# EAGLE design labwiz-module_t420 (EAGLE 6.5.0)

## Sheet 1 of 2
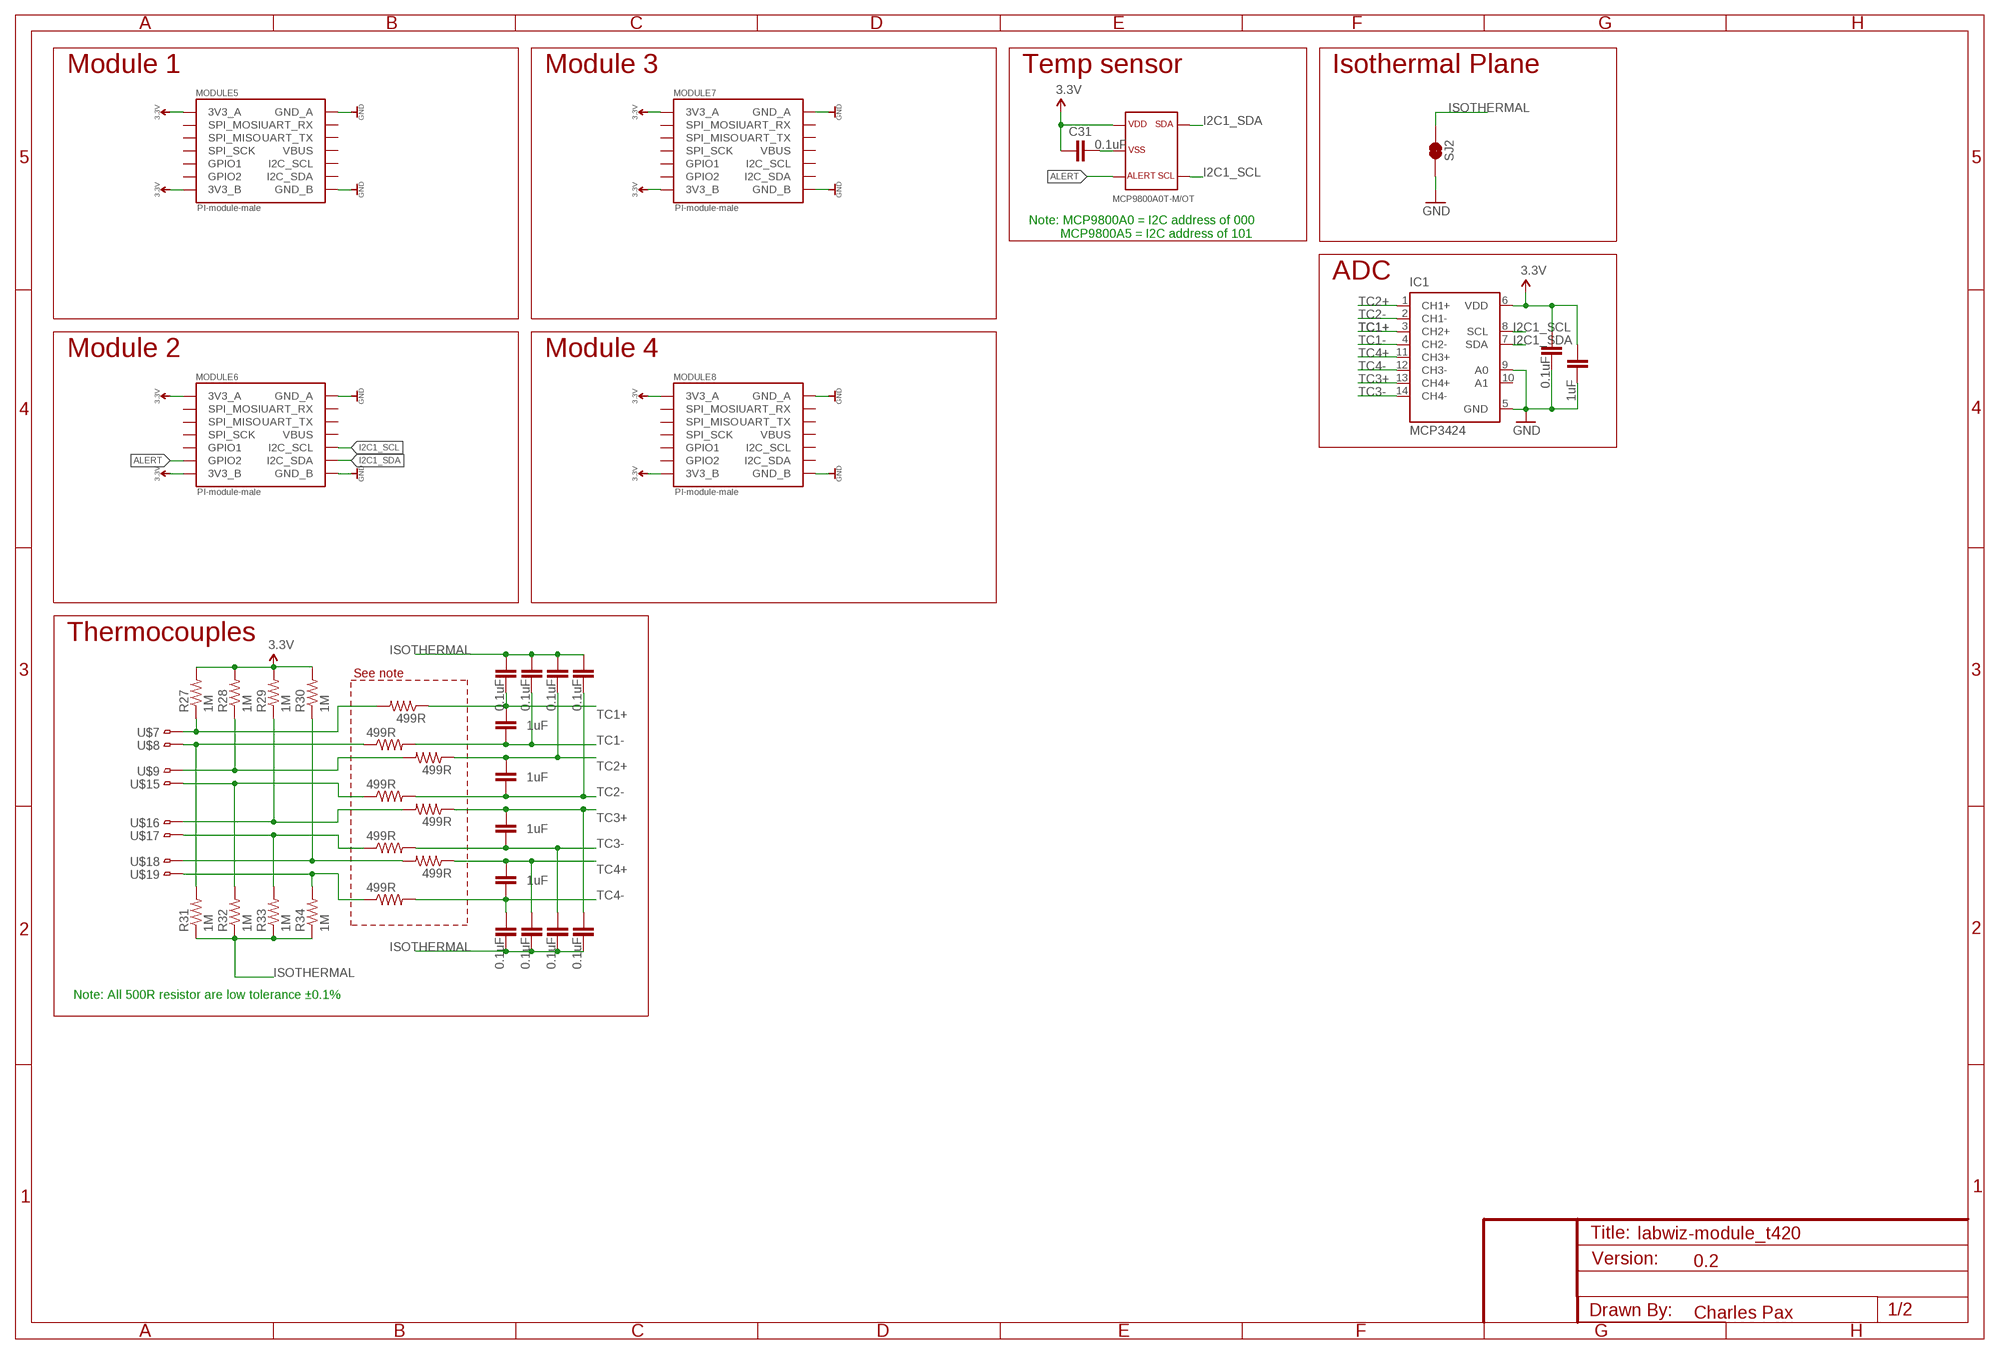
[diagram p0: schematic, sheet 1]

### Parts
C7  1uF  SPARKFUN-CAPACITORS_CAP0603-CAP  [SPARKFUN-CAPACITORS_0603-CAP]
C8  1uF  SPARKFUN-CAPACITORS_CAP0603-CAP  [SPARKFUN-CAPACITORS_0603-CAP]
C10  1uF  SPARKFUN-CAPACITORS_CAP0603-CAP  [SPARKFUN-CAPACITORS_0603-CAP]
C11  1uF  SPARKFUN-CAPACITORS_CAP0603-CAP  [SPARKFUN-CAPACITORS_0603-CAP]
C13  0.1uF  SPARKFUN-CAPACITORS_CAP0603-CAP  [SPARKFUN-CAPACITORS_0603-CAP]
C14  0.1uF  SPARKFUN-CAPACITORS_CAP0603-CAP  [SPARKFUN-CAPACITORS_0603-CAP]
C15  0.1uF  SPARKFUN-CAPACITORS_CAP0603-CAP  [SPARKFUN-CAPACITORS_0603-CAP]
C16  0.1uF  SPARKFUN-CAPACITORS_CAP0603-CAP  [SPARKFUN-CAPACITORS_0603-CAP]
C17  0.1uF  SPARKFUN-CAPACITORS_CAP0603-CAP  [SPARKFUN-CAPACITORS_0603-CAP]
C24  0.1uF  SPARKFUN-CAPACITORS_CAP0603-CAP  [SPARKFUN-CAPACITORS_0603-CAP]
C25  0.1uF  SPARKFUN-CAPACITORS_CAP0603-CAP  [SPARKFUN-CAPACITORS_0603-CAP]
C29  0.1uF  SPARKFUN-CAPACITORS_CAP0603-CAP  [SPARKFUN-CAPACITORS_0603-CAP]
C30  1uF  SPARKFUN-CAPACITORS_CAP0603-CAP  [SPARKFUN-CAPACITORS_0603-CAP]
C31  0.1uF  SPARKFUN-CAPACITORS_CAP0603-CAP  [SPARKFUN-CAPACITORS_0603-CAP]
C37  0.1uF  SPARKFUN-CAPACITORS_CAP0603-CAP  [SPARKFUN-CAPACITORS_0603-CAP]
IC1  MCP3424  [SO14]
MODULE5  PI-module-male  PAX_MODULE_EDGE_MALE_MODULE  [M07X2_2MM_EDGE]
MODULE6  PI-module-male  PAX_MODULE_EDGE_MALE_MODULE  [M07X2_2MM_EDGE]
MODULE7  PI-module-male  PAX_MODULE_EDGE_MALE_MODULE  [M07X2_2MM_EDGE]
MODULE8  PI-module-male  PAX_MODULE_EDGE_MALE_MODULE  [M07X2_2MM_EDGE]
R27  1M  SPARKFUN-RESISTORS_RESISTOR0603-RES  [SPARKFUN-RESISTORS_0603-RES]
R28  1M  SPARKFUN-RESISTORS_RESISTOR0603-RES  [SPARKFUN-RESISTORS_0603-RES]
R29  1M  SPARKFUN-RESISTORS_RESISTOR0603-RES  [SPARKFUN-RESISTORS_0603-RES]
R30  1M  SPARKFUN-RESISTORS_RESISTOR0603-RES  [SPARKFUN-RESISTORS_0603-RES]
R31  1M  SPARKFUN-RESISTORS_RESISTOR0603-RES  [SPARKFUN-RESISTORS_0603-RES]
R32  1M  SPARKFUN-RESISTORS_RESISTOR0603-RES  [SPARKFUN-RESISTORS_0603-RES]
R33  1M  SPARKFUN-RESISTORS_RESISTOR0603-RES  [SPARKFUN-RESISTORS_0603-RES]
R34  1M  SPARKFUN-RESISTORS_RESISTOR0603-RES  [SPARKFUN-RESISTORS_0603-RES]
R35  499R  SPARKFUN-RESISTORS_RESISTOR0603-RES  [SPARKFUN-RESISTORS_0603-RES]
R36  499R  SPARKFUN-RESISTORS_RESISTOR0603-RES  [SPARKFUN-RESISTORS_0603-RES]
R37  499R  SPARKFUN-RESISTORS_RESISTOR0603-RES  [SPARKFUN-RESISTORS_0603-RES]
R38  499R  SPARKFUN-RESISTORS_RESISTOR0603-RES  [SPARKFUN-RESISTORS_0603-RES]
R39  499R  SPARKFUN-RESISTORS_RESISTOR0603-RES  [SPARKFUN-RESISTORS_0603-RES]
R40  499R  SPARKFUN-RESISTORS_RESISTOR0603-RES  [SPARKFUN-RESISTORS_0603-RES]
R41  499R  SPARKFUN-RESISTORS_RESISTOR0603-RES  [SPARKFUN-RESISTORS_0603-RES]
R42  499R  SPARKFUN-RESISTORS_RESISTOR0603-RES  [SPARKFUN-RESISTORS_0603-RES]
SJ2  JUMPER-PAD-2-NC_BY_TRACE  [PAD-JUMPER-2-NC_BY_TRACE_YES_SILK]
U1  MCP9800  [SOT23-5L]
U$7  TC-MINI-SINGLE  [TC-CLIP-SINGLE]
U$8  TC-MINI-SINGLE  [TC-CLIP-SINGLE]
U$9  TC-MINI-SINGLE  [TC-CLIP-SINGLE]
U$15  TC-MINI-SINGLE  [TC-CLIP-SINGLE]
U$16  TC-MINI-SINGLE  [TC-CLIP-SINGLE]
U$17  TC-MINI-SINGLE  [TC-CLIP-SINGLE]
U$18  TC-MINI-SINGLE  [TC-CLIP-SINGLE]
U$19  TC-MINI-SINGLE  [TC-CLIP-SINGLE]

### Nets
3.3V: C29.1 C30.1 C31.1 IC1.6(VDD) MODULE5.P$1(3V3_B) MODULE5.P$13(3V3_A) MODULE6.P$1(3V3_B) MODULE6.P$13(3V3_A) MODULE7.P$1(3V3_B) MODULE7.P$13(3V3_A) MODULE8.P$1(3V3_B) MODULE8.P$13(3V3_A) R27.2 R28.2 R29.2 R30.2 U1.1
ALERT: MODULE6.P$3(GPIO2) U1.3
GND: C29.2 C30.2 IC1.5(GND) IC1.9(A0) MODULE5.P$2(GND_B) MODULE5.P$14(GND_A) MODULE6.P$2(GND_B) MODULE6.P$14(GND_A) MODULE7.P$2(GND_B) MODULE7.P$14(GND_A) MODULE8.P$2(GND_B) MODULE8.P$14(GND_A) SJ2.1
I2C1_SCL: IC1.8(SCL) MODULE6.P$6(I2C_SCL) U1.4
I2C1_SDA: IC1.7(SDA) MODULE6.P$4(I2C_SDA) U1.5
ISOTHERMAL: C13.2 C14.2 C15.2 C16.2 C17.1 C24.1 C25.1 C31.2 C37.1 R31.1 R32.1 R33.1 R34.1 SJ2.2 U1.2
N$1: R27.1 R35.2 U$7.P$1
N$4: R32.2 R38.1 U$15.P$1
N$5: R31.2 R36.1 U$8.P$1
N$10: R28.1 R37.2 U$9.P$1
N$12: R30.1 R40.2 U$18.P$1
N$13: R29.1 R39.2 U$16.P$1
N$14: R33.2 R41.1 U$17.P$1
N$16: R34.2 R42.1 U$19.P$1
TC1+: C7.1 C17.2 IC1.3(CH2+) R35.1
TC1-: C7.2 C24.2 IC1.4(CH2-) R36.2
TC2+: C8.1 C25.2 IC1.1(CH1+) R37.1
TC2-: C8.2 C37.2 IC1.2(CH1-) R38.2
TC3+: C10.1 C16.1 IC1.13(CH4+) R39.1
TC3-: C10.2 C15.1 IC1.14(CH4-) R41.2
TC4+: C11.1 C14.1 IC1.11(CH3+) R40.1
TC4-: C11.2 C13.1 IC1.12(CH3-) R42.2
Unconnected: IC1.10(A1) MODULE5.P$3(GPIO2) MODULE5.P$4(I2C_SDA) MODULE5.P$5(GPIO1) MODULE5.P$6(I2C_SCL) MODULE5.P$7(SPI_SCK) MODULE5.P$8(VBUS) MODULE5.P$9(SPI_MISO) MODULE5.P$10(UART_TX) MODULE5.P$11(SPI_MOSI) MODULE5.P$12(UART_RX) MODULE6.P$5(GPIO1) MODULE6.P$7(SPI_SCK) MODULE6.P$8(VBUS) MODULE6.P$9(SPI_MISO) MODULE6.P$10(UART_TX) MODULE6.P$11(SPI_MOSI) MODULE6.P$12(UART_RX) MODULE7.P$3(GPIO2) MODULE7.P$4(I2C_SDA) MODULE7.P$5(GPIO1) MODULE7.P$6(I2C_SCL) MODULE7.P$7(SPI_SCK) MODULE7.P$8(VBUS) MODULE7.P$9(SPI_MISO) MODULE7.P$10(UART_TX) MODULE7.P$11(SPI_MOSI) MODULE7.P$12(UART_RX) MODULE8.P$3(GPIO2) MODULE8.P$4(I2C_SDA) MODULE8.P$5(GPIO1) MODULE8.P$6(I2C_SCL) MODULE8.P$7(SPI_SCK) MODULE8.P$8(VBUS) MODULE8.P$9(SPI_MISO) MODULE8.P$10(UART_TX) MODULE8.P$11(SPI_MOSI) MODULE8.P$12(UART_RX)

### Notes on the sheet
- Module 1 | Module 3 | Temp sensor | Isothermal Plane
- Note: MCP9800A0 = I2C address of 000
           MCP9800A5 = I2C address of 101
- ADC
- Module 2 | Module 4
- Thermocouples
- See note
- Note: All 500R resistor are low tolerance ±0.1%
- 0.2
- Charles Pax

## Sheet 2 of 2

## Library data of the parts
C7 C8 C10 C11 C13-C17 C24 C25 C29-C31 C37 = PaxInstrument-T400:SPARKFUN-CAPACITORS_CAP: Capacitor Standard 0603 ceramic capacitor, and 0.1" leaded capacitor.
IC1 = JeeLabs:MCP3424: 18-Bit, 4-Channel Sampling ANALOG-TO-DIGITAL CONVERTER with I2C? Interface Source: www.ti.com .. ADS7828.pdf; MF: Microchip Technology; MPN: MCP3424-E/SL
MODULE5-MODULE8 = PaxInstruments-Connectors:PAX_MODULE; MF: Pax Instruments; MPN: PIxxxx
R27-R34 = PaxInstrument-T400:SPARKFUN-RESISTORS_RESISTOR: Resistor Basic schematic elements and footprints for 0603, 1206, and PTH resistors.
R35-R42 = PaxInstrument-T400:SPARKFUN-RESISTORS_RESISTOR: Resistor Basic schematic elements and footprints for 0603, 1206, and PTH resistors.; MF: Vishay; MPN: TNPW0603499RBEEA
SJ2 = SparkFun-Passives:JUMPER-PAD-2-NC_BY_TRACE; MF: N/A; MPN: N/A
U1 = newparts_2010:MCP9800: Temperature sensor I2C output, Microchip. Farnell 1439485; MF: Microchip Technology; MPN: MCP9800A0T-M/OT
U$7-U$9 U$15-U$19 = PaxInstruments-Connectors:TC-MINI-SINGLE; MF: Pax Instrument; MPN: Thermo-clip2

## Net classes
0 Digital signal: width 0.1 mm, drill 0.2 mm, clearance 0.15 mm
1 3.3V power: width 0.1 mm, drill 0.2 mm, clearance 0.15 mm
2 RTC battery: width 0.1 mm, drill 0.2 mm, clearance 0.15 mm
3 5V power: width 0.1 mm, drill 0.2 mm, clearance 0.15 mm
4 Analog signal: width 0.1 mm, drill 0.2 mm, clearance 0.15 mm
5 GND: width 0.1 mm, drill 0.2 mm, clearance 0.15 mm

## Board
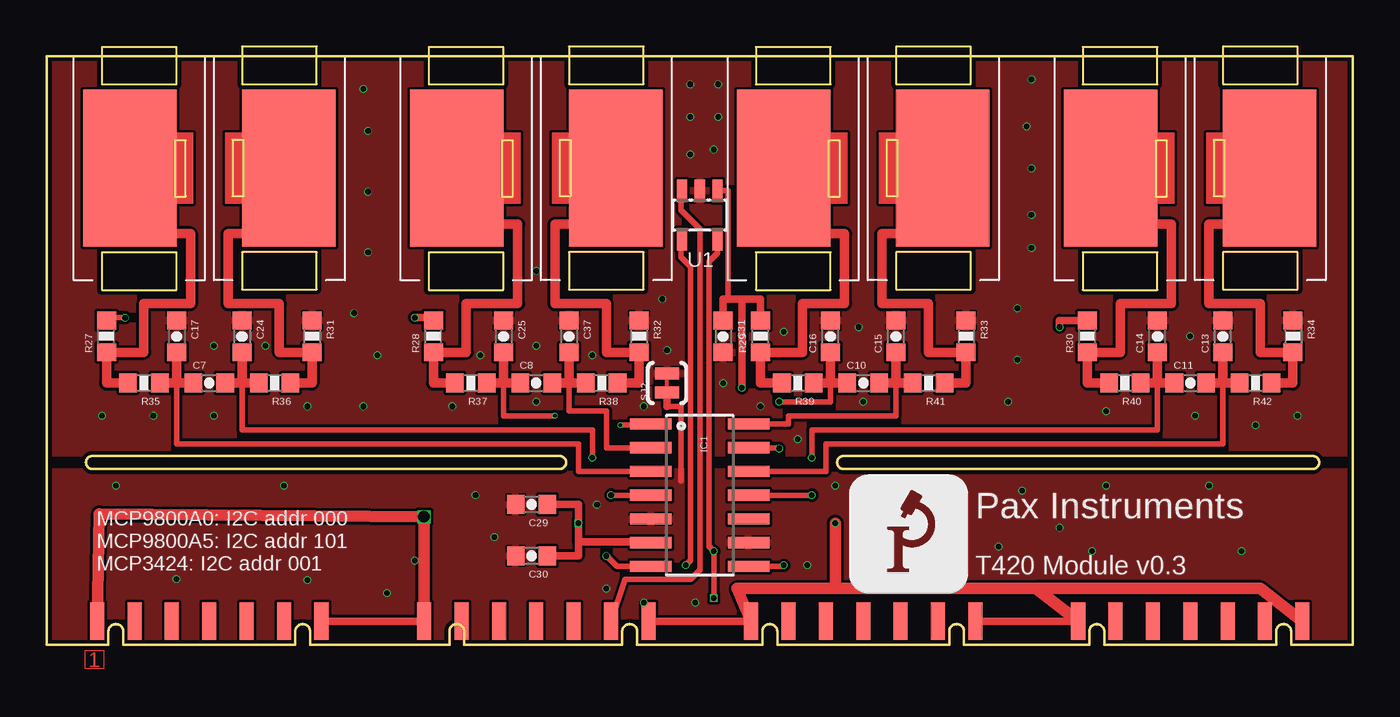
[diagram p1: board, top side]
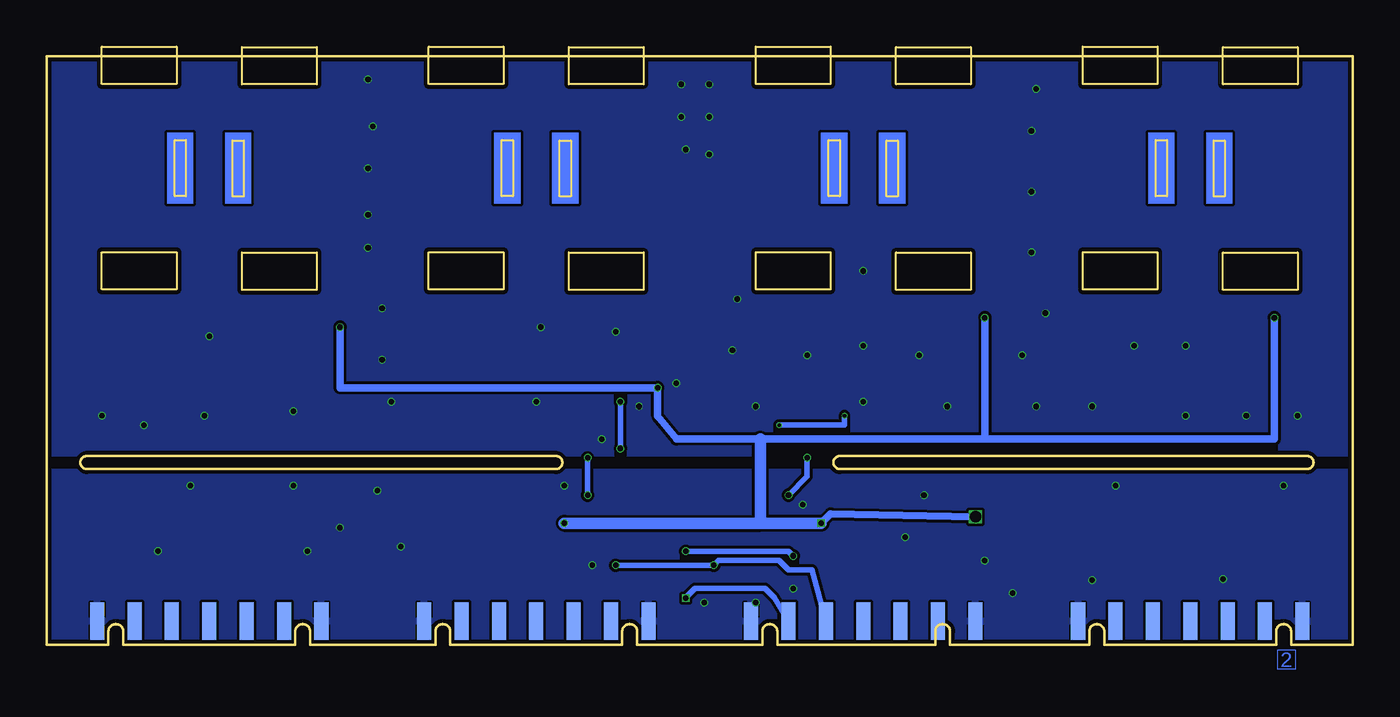
[diagram p2: board, bottom side, seen from below]

Size 69.9 x 31.5 mm. Coordinates in mm from the lower left corner, seen from the top.
Outline: 0,31.5 0,0 3.3,0 3.3,0.7 arc-180 4.1,0.7 4.1,0 13.3,0 13.3,0.7 arc-180 14.1,0.7 14.1,0 21.55,0 21.55,0.7 arc-180 22.35,0.7 22.35,0 30.8,0 30.8,0.7 arc-180 31.6,0.7 31.6,0 38.3,0 38.3,0.7 arc-180 39.1,0.7 39.1,0 48.3,0 48.3,0.7 arc-180 49.1,0.7 49.1,0 55.8,0 55.8,0.7 arc-180 56.6,0.7 56.6,0 65.8,0 65.8,0.7 arc-180 66.6,0.7 66.6,0 69.9,0 69.9,31.5 0,31.5
Outline: 2.45,9.4 arc-180 2.45,10.1 27.45,10.1 arc-180 27.45,9.4 2.45,9.4
Outline: 42.65,9.4 arc-180 42.65,10.1 67.75,10.1 arc-180 67.75,9.4 42.65,9.4
Copper layers (1*2+15*16): Top 0.017mm / dielectric 0.5mm / GND 0.017mm / dielectric 0.075mm / 3.3V 0.017mm / dielectric 0.5mm / Bottom 0.017mm
Design rules "PaxInstrument-T400 *": minimum track width 0.1mm, minimum drill 0.2mm, track to track 0.075mm, track to pad 0.075mm, pad to pad 0.075mm, via to via 0.075mm, smd to smd 0.075mm, copper to edge 0.2mm, drill to drill 0.2mm, minimum pad ring 0.5mm, minimum via ring 0.05mm, stop-mask expansion 0.01mm, vias tented up to drill 0.25mm, thermal gap 0.1mm
tKeepout: area 33.2,26.5 to 36.2,27.5
vRestrict: area 4,0 to 70,34.5

### Footprints (pad centres in the part's own frame; a part is rotated, then mirrored left to right if it is on the bottom)
SPARKFUN-CAPACITORS_0603-CAP = smd 0.94 x 1.016: 1 -0.85,0; 2 0.85,0
SO14 = smd 0.61 x 2.21: 1 -3.81,-2.616; 2 -2.54,-2.616; 3 -1.27,-2.616; 4 0,-2.616; 5 1.27,-2.616; 6 2.54,-2.616; 7 3.81,-2.616; 8 3.81,2.616; 9 2.54,2.616; 10 1.27,2.616; 11 0,2.616; 12 -1.27,2.616; 13 -2.54,2.616; 14 -3.81,2.616
M07X2_2MM_EDGE = smd 0.75 x 2: P$1 0,-0.25; P$3 2,-0.25; P$5 4,-0.25; P$7 6,-0.25; P$9 8,-0.25; P$11 10,-0.25; P$13 12,-0.25 | smd 0.75 x 2 bottom: P$2 0,-0.25; P$4 2,-0.25; P$6 4,-0.25; P$8 6,-0.25; P$10 8,-0.25; P$12 10,-0.25; P$14 12,-0.25
SPARKFUN-RESISTORS_0603-RES = smd 0.94 x 1.016: 1 -0.85,0; 2 0.85,0
PAD-JUMPER-2-NC_BY_TRACE_YES_SILK = smd 0.635 x 1.27: 1 -0.508,0; 2 0.508,0
SOT23-5L = smd 0.55 x 1.2: 1 -0.95,-1.3; 2 0,-1.3; 3 0.95,-1.3; 4 0.95,1.3; 5 -0.95,1.3
TC-CLIP-SINGLE = smd 5 x 8.4: P$1 -0.5,0

### Placement (x,y rotation side)
C7  8.7,14 0 top
C8  26.2,14 0 top
C10  43.7,14 0 top
C11  61.2,14 0 top
C13  62.95,16.5 90 top
C14  59.45,16.5 90 top
C15  45.45,16.5 90 top
C16  41.95,16.5 90 top
C17  6.95,16.5 270 top
C24  10.45,16.5 270 top
C25  24.45,16.5 270 top
C29  25.95,7.5 180 top
C30  25.95,4.75 180 top
C31  36.2,16.5 270 top
C37  27.95,16.5 270 top
IC1  34.95,8 270 top
MODULE5  14.7,1 180 top
MODULE6  32.2,1 180 top
MODULE7  49.7,1 180 top
MODULE8  67.2,1 180 top
R27  3.2,16.5 90 top
R28  20.7,16.5 90 top
R29  38.2,16.5 90 top
R30  55.7,16.5 90 top
R31  14.2,16.5 270 top
R32  31.7,16.5 270 top
R33  49.2,16.5 270 top
R34  66.7,16.5 270 top
R35  5.2,14 180 top
R36  12.2,14 180 top
R37  22.7,14 180 top
R38  29.7,14 180 top
R39  40.2,14 180 top
R40  57.7,14 180 top
R41  47.2,14 180 top
R42  64.7,14 180 top
SJ2  33.2,14 90 top
U1  34.95,23 180 top
U$1  [PAX-LOGO-0.25IN]  42.95,2.75 0 top
U$2  [LAYERS-LABEL-2]  2.05,-1.3 0 top
U$7  4.95,25.5 0 top
U$8  12.45,25.5 180 top
U$9  22.45,25.5 0 top
U$15  29.95,25.5 180 top
U$16  39.95,25.5 0 top
U$17  47.45,25.5 180 top
U$18  57.45,25.5 0 top
U$19  64.95,25.5 180 top

### Tracks (layer width: path | path; a pad name or v marks a point on that pad's centre or on a via)
3.3V  (via drill 0.3, 0.6)
  Top 0.305: 36.2,18.5 36.45,18.5 36.45,24.3 U1.1 | R27.2 3.2,17.5 v4.2,17.5
  Top 0.406: v54.2,17 54.2,17.35 R30.2 | R28.2 20.7,17.5 v19.7,17.5 | R29.2 38.2,18.5 37.2,18.5 | 37.2,18.5 v37.2,13.75 | 37.2,18.5 36.2,18.5 C31.1 | v28.45,6.5 28.45,4.75 C30.1 | IC1.6 32.45,5.5 28.45,5.5 v28.45,6.5 | C29.1 28.45,7.5 v28.45,6.5 | MODULE6.P$13 MODULE5.P$1 | MODULE6.P$1 MODULE7.P$13 | MODULE8.P$13 MODULE7.P$1
  Top 0.61: MODULE6.P$13 v20.19,6.85 2.82,7 MODULE5.P$13 | MODULE7.P$13 36.95,3 42.2,3 | 42.2,3 52.95,3 | 52.95,3 MODULE8.P$13 | 42.2,3 v42.2,6.5 | MODULE8.P$1 64.95,3 52.95,3
  Bottom 0.406: v4.2,17.5 4.2,11 19.7,11 | 19.7,11 31.7,11 36.2,11 37.2,12.25 v37.2,13.75 54.2,13.75 v54.2,17 | v19.7,17.5 19.7,11 | v28.45,6.5 27.95,7 v20.19,6.85
  Bottom 0.61: v28.45,6.5 31.7,6.5 | 31.7,6.5 31.7,11 | v42.2,6.5 31.7,6.5
ALERT
  Top 0.305: U1.3 33.95,24.25 33.95,23.25 34.95,22.25 34.95,4 34.45,3.5 30.95,3.5 MODULE6.P$3
GND  (via drill 0.3)
  Top 0.305: 33.2,12.75 33.95,12.75 33.95,8.75
  Top 0.406: SJ2.1 33.2,12.75
  other vias: 22.95,8 19.7,4.5 3.7,8.5 31.95,2.25 6.95,3.5 13.95,3.45 34.7,2.25 54.2,6.25 42.2,8.5 52.2,8.25 50.95,5.25 56.7,8.5 55.95,5 62.2,8.5 63.95,5 18.2,2.75 23.95,5.75 29.45,7.5 29.95,3 40.7,4.25 12.7,8.5
  pour Bottom: -0.05,9.25 0,0 69.9,0 69.95,9.25
  pour Top: -0.05,9.25 0,0.05 69.9,0 69.95,9.25
I2C1_SCL  (via drill 0.3)
  Top 0.305: U1.4 33.95,21.7 33.95,20.75 34.45,20.25 34.45,4.5 v34.2,4.25 | IC1.8 39.39,4.19 v39.45,4.25
  Bottom 0.305: v39.45,4.25 v34.2,4.25 33.95,4.5 30.7,4.5 30.2,4 28.95,4 MODULE6.P$6
I2C1_SDA  (via drill 0.3)
  Top 0.305: U1.5 35.9,20.95 35.45,20.5 35.45,5.25 v35.7,5 v35.7,2.5 | IC1.7 30.51,4.19 v29.95,4.75
  Bottom 0.305: v29.95,4.75 30.2,5 v35.7,5 | MODULE6.P$4 30.95,2.5 31.45,3 35.2,3 v35.7,2.5
ISOTHERMAL  (via drill 0.3)
  other vias: 17.7,15.5 23.2,15.5 26.2,16 29.2,15.5 8.95,16 11.7,16 8.95,12.25 5.7,12.25 2.95,12.25 13.95,12.75 16.95,12.75 16.45,17.75 17.2,21 17.2,24.25 17.2,27.5 16.95,29.75 34.45,30 35.95,30 34.45,28.25 35.95,28.25 34.45,26.25 35.7,26.5 52.7,30.25 52.45,27.75 52.7,25.5 52.7,23 52.7,21.25 51.95,18 38.2,12.75 51.45,13 51.95,15.25 56.7,12.5 61.45,12.25 61.2,16.5 64.7,11.75 66.95,12.25 43.45,17 43.7,13 39.45,16.75 36.2,14 26.2,20 32.95,18.5 33.2,15.75 31.95,12.75 21.7,12.75 26.2,13 40.2,11
  pour Bottom: -0.25,31.75 69.9,31.5 69.95,10.25 -0.05,10.25
  pour Top: -0.25,31.75 69.9,31.5 69.95,10.25 -0.05,10.25
N$1
  Top 0.5: R35.2 3.2,14 R27.1 5.2,15.65 5.2,18.25 7.7,18.25 7.7,22 4.45,22 U$7.P$1
N$4
  Top 0.5: R38.1 31.7,14 R32.2 29.95,15.65 29.95,18.25 27.2,18.25 27.2,22.5 30.45,22.5 U$15.P$1
N$5
  Top 0.5: R36.1 14.2,14 R31.2 12.45,15.65 12.45,18.25 9.7,18.25 9.7,22 12.95,22 U$8.P$1
N$10
  Top 0.5: R37.2 20.7,14 R28.1 22.45,15.65 22.45,18.25 25.2,18.25 25.2,22.5 21.95,22.5 U$9.P$1
N$12
  Top 0.5: R40.2 55.7,14 R30.1 57.45,15.65 57.45,18.25 60.2,18.25 60.2,22.5 56.95,22.5 U$18.P$1
N$13
  Top 0.5: R39.2 38.2,14 R29.1 40.45,15.65 40.45,18.25 42.7,18.25 42.7,22 39.45,22 U$16.P$1
N$14
  Top 0.5: R41.1 49.2,14 R33.2 47.2,15.65 47.2,18.25 44.7,18.25 44.7,22 47.95,22 U$17.P$1
N$16
  Top 0.5: R42.1 66.7,14 R34.2 64.95,15.65 64.95,18.25 62.2,18.25 62.2,22.5 65.45,22.5 U$19.P$1
TC1+
  Top 0.305: 6.95,14 6.95,10.75 28.45,10.75 28.45,9.27 IC1.3
  Top 0.5: R35.1 6.95,14 | C17.2 6.95,14 | C7.1 6.95,14
TC1-  (via drill 0.3)
  Top 0.305: 10.45,14 10.45,11.5 29.2,11.5 v29.2,10 | v30.2,8 IC1.4
  Top 0.5: C7.2 10.45,14 | C24.2 10.45,14 | R36.2 10.45,14
  Bottom 0.305: v29.2,10 29.2,9 v30.2,8
TC2+  (via drill 0.2)
  Top 0.305: 24.45,14 24.45,12.25 v27.2,12.25 | v30.7,11.75 32.27,11.75 IC1.1
  Top 0.5: R37.1 24.45,14 | C25.2 24.45,14 | C8.1 24.45,14
  Bottom 0.305: v27.2,12.25 27.2,11.75 v30.7,11.75
TC2-
  Top 0.305: 27.95,14 27.95,12.5 29.95,12.5 29.95,10.54 IC1.2
  Top 0.5: C8.2 27.95,14 | 27.95,14 R38.2 | C37.2 27.95,14
TC3+  (via drill 0.3)
  Top 0.305: 41.95,14 41.95,13 v39.2,13 | v39.2,10.5 39.2,10.54 IC1.13
  Top 0.5: R39.1 41.95,14 | 41.95,14 C10.1 | C16.1 41.95,14
  Bottom 0.305: v39.2,13 v39.2,10.5
TC3-
  Top 0.305: 45.45,14 45.45,12.25 39.7,12.25 39.7,11.81 IC1.14
  Top 0.5: C10.2 45.45,14 | 45.45,14 R41.2 | C15.1 45.45,14
TC4+  (via drill 0.3)
  Top 0.305: 59.45,14 59.45,11.5 40.95,11.5 v40.95,10 | v40.95,8 IC1.11
  Top 0.5: R40.1 59.45,14 | 59.45,14 C11.1 | C14.1 59.45,14
  Bottom 0.305: v40.95,10 v40.95,8
TC4-
  Top 0.305: 62.95,14 62.95,10.75 41.7,10.75 41.7,9.27 IC1.12
  Top 0.5: C11.2 62.95,14 | 62.95,14 R42.2 | C13.1 62.95,14

### Text on the board
tPlace: MCP9800A0: I2C addr 000 / MCP9800A5: I2C addr 101 / MCP3424: I2C addr 001 | Pax Instruments | T420 Module v0.3
vRestrict: Height restriction / 4.7 mm